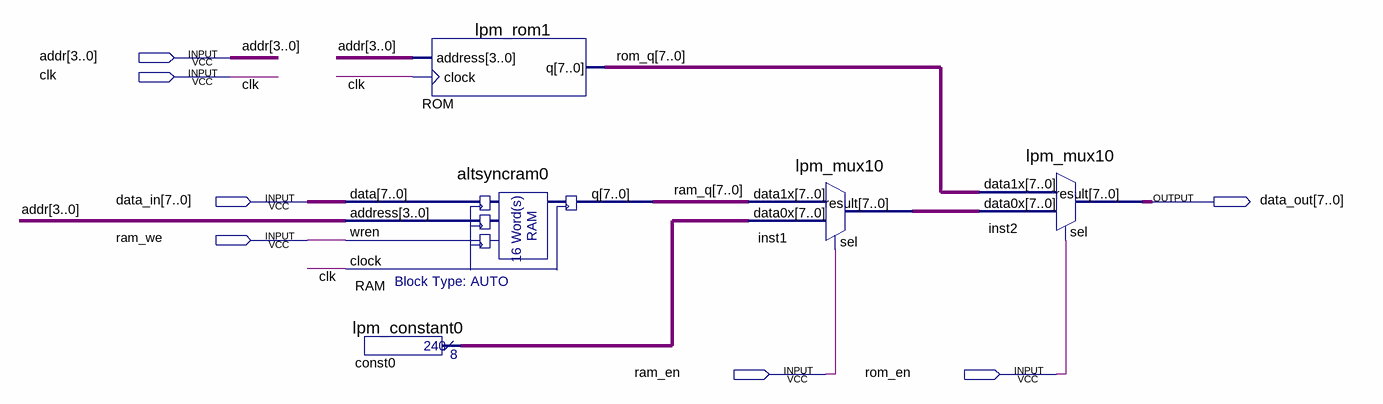
[diagram p0: schematic sheet]
// Quartus schematic memory_unit.bdf as structural Verilog: 5 symbols, 7 pins
module memory_unit (
  input  [3:0] addr,
  input  clk,
  input  [7:0] data_in,
  input  ram_we,
  input  ram_en,
  input  rom_en,
  output [7:0] data_out
);

  wire [7:0] const0_result, inst1_result, ram_q, rom_q;

  altsyncram0 RAM (.data(data_in), .address(addr), .wren(ram_we), .clock(clk), .q(ram_q));
  lpm_constant0 const0 (.result(const0_result));
  lpm_rom1 ROM (.address(addr), .clock(clk), .q(rom_q));
  lpm_mux10 inst1 (.data1x(ram_q), .data0x(const0_result), .sel(ram_en), .result(inst1_result));
  lpm_mux10 inst2 (.data1x(rom_q), .data0x(inst1_result), .sel(rom_en), .result(data_out));
endmodule
